# EAGLE design customESC_Test (EAGLE 9.6.2)

## Sheet 1 of 2
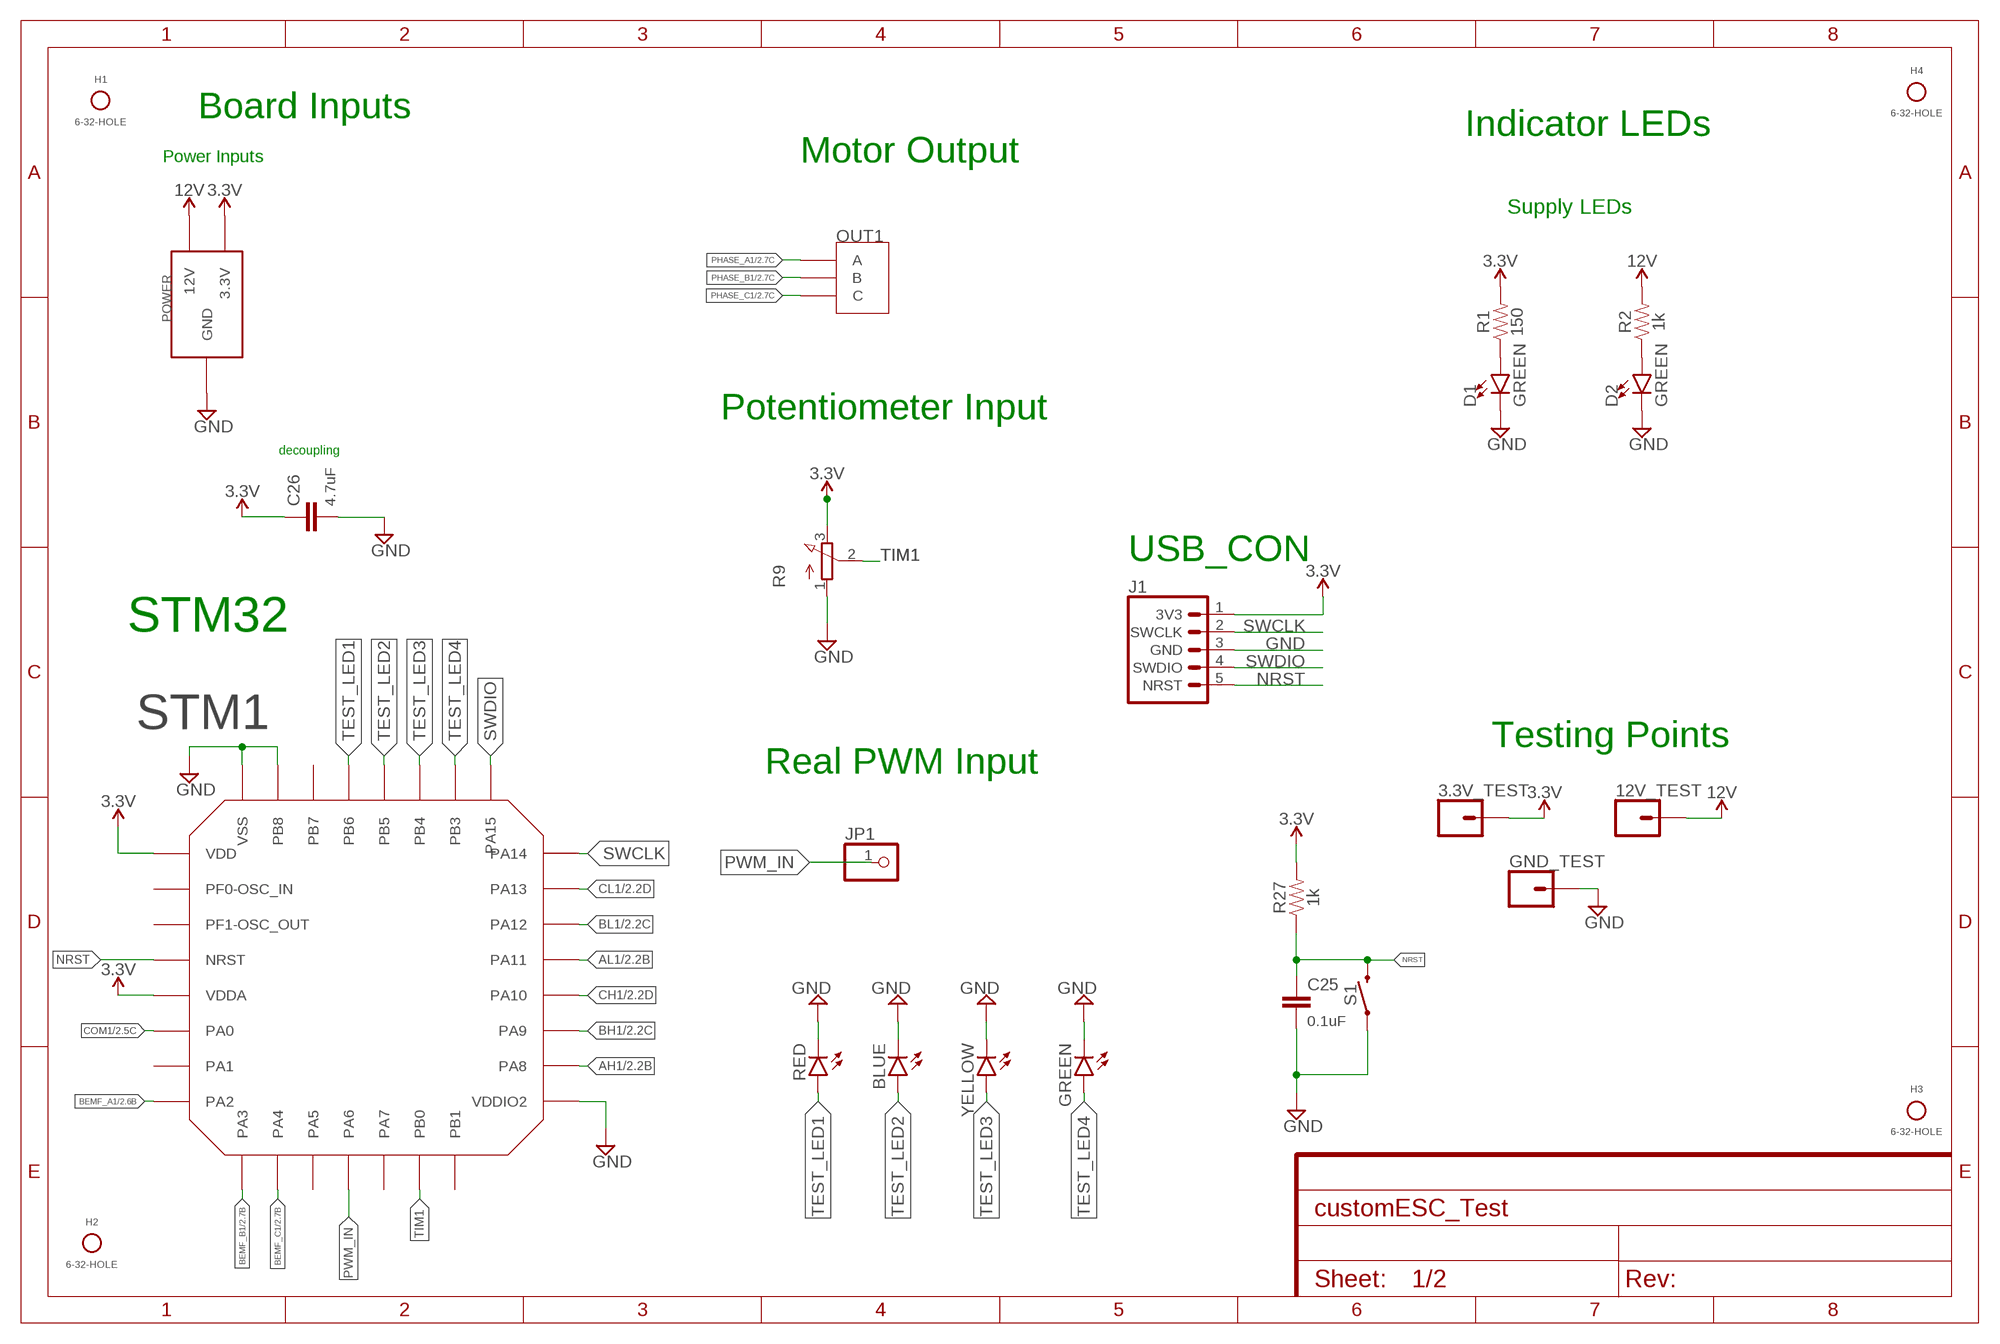
[diagram p0: schematic, sheet 1]

### Parts
3.3V_TEST  CONN_01  [1X01]
12V_TEST  CONN_01  [1X01]
BLUE  LEDCHIPLED_0805  [CHIPLED_0805]
C25  0.1uF  10UF-0603-6.3V-20%  [0603]
C26  4.7uF  10UF-0603-6.3V-20%  [0603]
D1  GREEN  LED-GREEN0603  [LED-0603]
D2  GREEN  LED-GREEN0603  [LED-0603]
GND_TEST  CONN_01  [1X01]
GREEN  LEDCHIPLED_0805  [CHIPLED_0805]
H1  6-32-HOLE  [MOUNTING_HOLE]
H2  6-32-HOLE  [MOUNTING_HOLE]
H3  6-32-HOLE  [MOUNTING_HOLE]
H4  6-32-HOLE  [MOUNTING_HOLE]
J1  3V3 -SWCLK-GND-SWDIO- NRST  SWD_CONN  [1X05]
JP1  PINHD-1X1  [1X01]
OUT1  IPBT-103-H1-T-S  [IPBT-103-H1-T-S]
POWER  12V-CONNECTOR  [12V-CONNECTOR]
R1  150  1KOHM-0603-1/10W-1%  [0603]
R2  1k  1KOHM-0603-1/10W-1%  [0603]
R9  3RP/1610N  [3RP/1610N]
R27  1k  1KOHM-0603-1/10W-1%  [0603]
RED  LEDCHIPLED_0805  [CHIPLED_0805]
S1  MOMENTARY-SWITCH-SPST-SMD-6.0X3.5MM  [TACTILE_SWITCH_SMD_6.0X3.5MM]
STM1  STM32F042K6T6  [STM32F042K6T6]
YELLOW  LEDCHIPLED_0805  [CHIPLED_0805]

### Nets
AH1: STM1.PA8 ; also sheet 2
AL1: STM1.PA11 ; also sheet 2
BEMF_A1: STM1.PA2 ; also sheet 2
BEMF_B1: STM1.PA3 ; also sheet 2
BEMF_C1: STM1.PA4 ; also sheet 2
BH1: STM1.PA9 ; also sheet 2
BL1: STM1.PA12 ; also sheet 2
CH1: STM1.PA10 ; also sheet 2
CL1: STM1.PA13 ; also sheet 2
COM1: STM1.PA0 ; also sheet 2
GND: BLUE.C C25.2 C26.2 D1.C D2.C GND_TEST.1 GREEN.C J1.3(GND) POWER.GND POWER.GND@1(GND) POWER.GND@2(GND) POWER.GND@3(GND) POWER.GND@4(GND) POWER.GND@5(GND) POWER.GND@6(GND) POWER.GND@7(GND) POWER.GND@8(GND) POWER.GND@9(GND) POWER.GND@10(GND) POWER.GND@11(GND) POWER.GND@12(GND) R9.1(A) RED.C S1.1 STM1.PB8-BOOT0(PB8) STM1.VDDIO2 STM1.VSS STM1.VSS1(VSS) YELLOW.C ; also sheet 2
N$1: D1.A R1.1
N$2: D2.A R2.1
NRST: C25.1 J1.5(NRST) R27.1 S1.2 STM1.NRST
PHASE_A1: OUT1.1(A) ; also sheet 2
PHASE_B1: OUT1.2(B) ; also sheet 2
PHASE_C1: OUT1.3(C) ; also sheet 2
PWM_IN: JP1.1 STM1.PA6
SWCLK: J1.2(SWCLK) STM1.PA14
SWDIO: J1.4(SWDIO) STM1.PA15
TEST_LED1: RED.A STM1.PB6
TEST_LED2: BLUE.A STM1.PB5
TEST_LED3: STM1.PB4 YELLOW.A
TEST_LED4: GREEN.A STM1.PB3
TIM1: R9.2(S) STM1.PB0
VCC_1: 3.3V_TEST.1 C26.1 J1.1(3V3) POWER.3.3V R1.2 R9.3(E) R27.2 STM1.VDD STM1.VDDA ; supply symbol labelled 3.3V
VCC_2: 12V_TEST.1 POWER.12V@1(12V) POWER.12V@2(12V) POWER.12V@3(12V) POWER.12V@4(12V) POWER.12V@5(12V) POWER.12V@6(12V) POWER.12V@7(12V) POWER.12V@8(12V) POWER.12V@9(12V) POWER.12V@10(12V) POWER.12V@11(12V) POWER.12V@12(12V) R2.2 ; supply symbol labelled 12V ; also sheet 2
Unconnected: STM1.PA1 STM1.PA5 STM1.PA7 STM1.PB1 STM1.PB7 STM1.PF0-OSC_IN STM1.PF1-OSC_OUT

### Notes on the sheet
- Board Inputs
- Indicator LEDs
- Power Inputs | Motor Output
- Supply LEDs
- Potentiometer Input
- decoupling
- USB_CON
- STM32
- Testing Points
- Real PWM Input

## Sheet 2 of 2
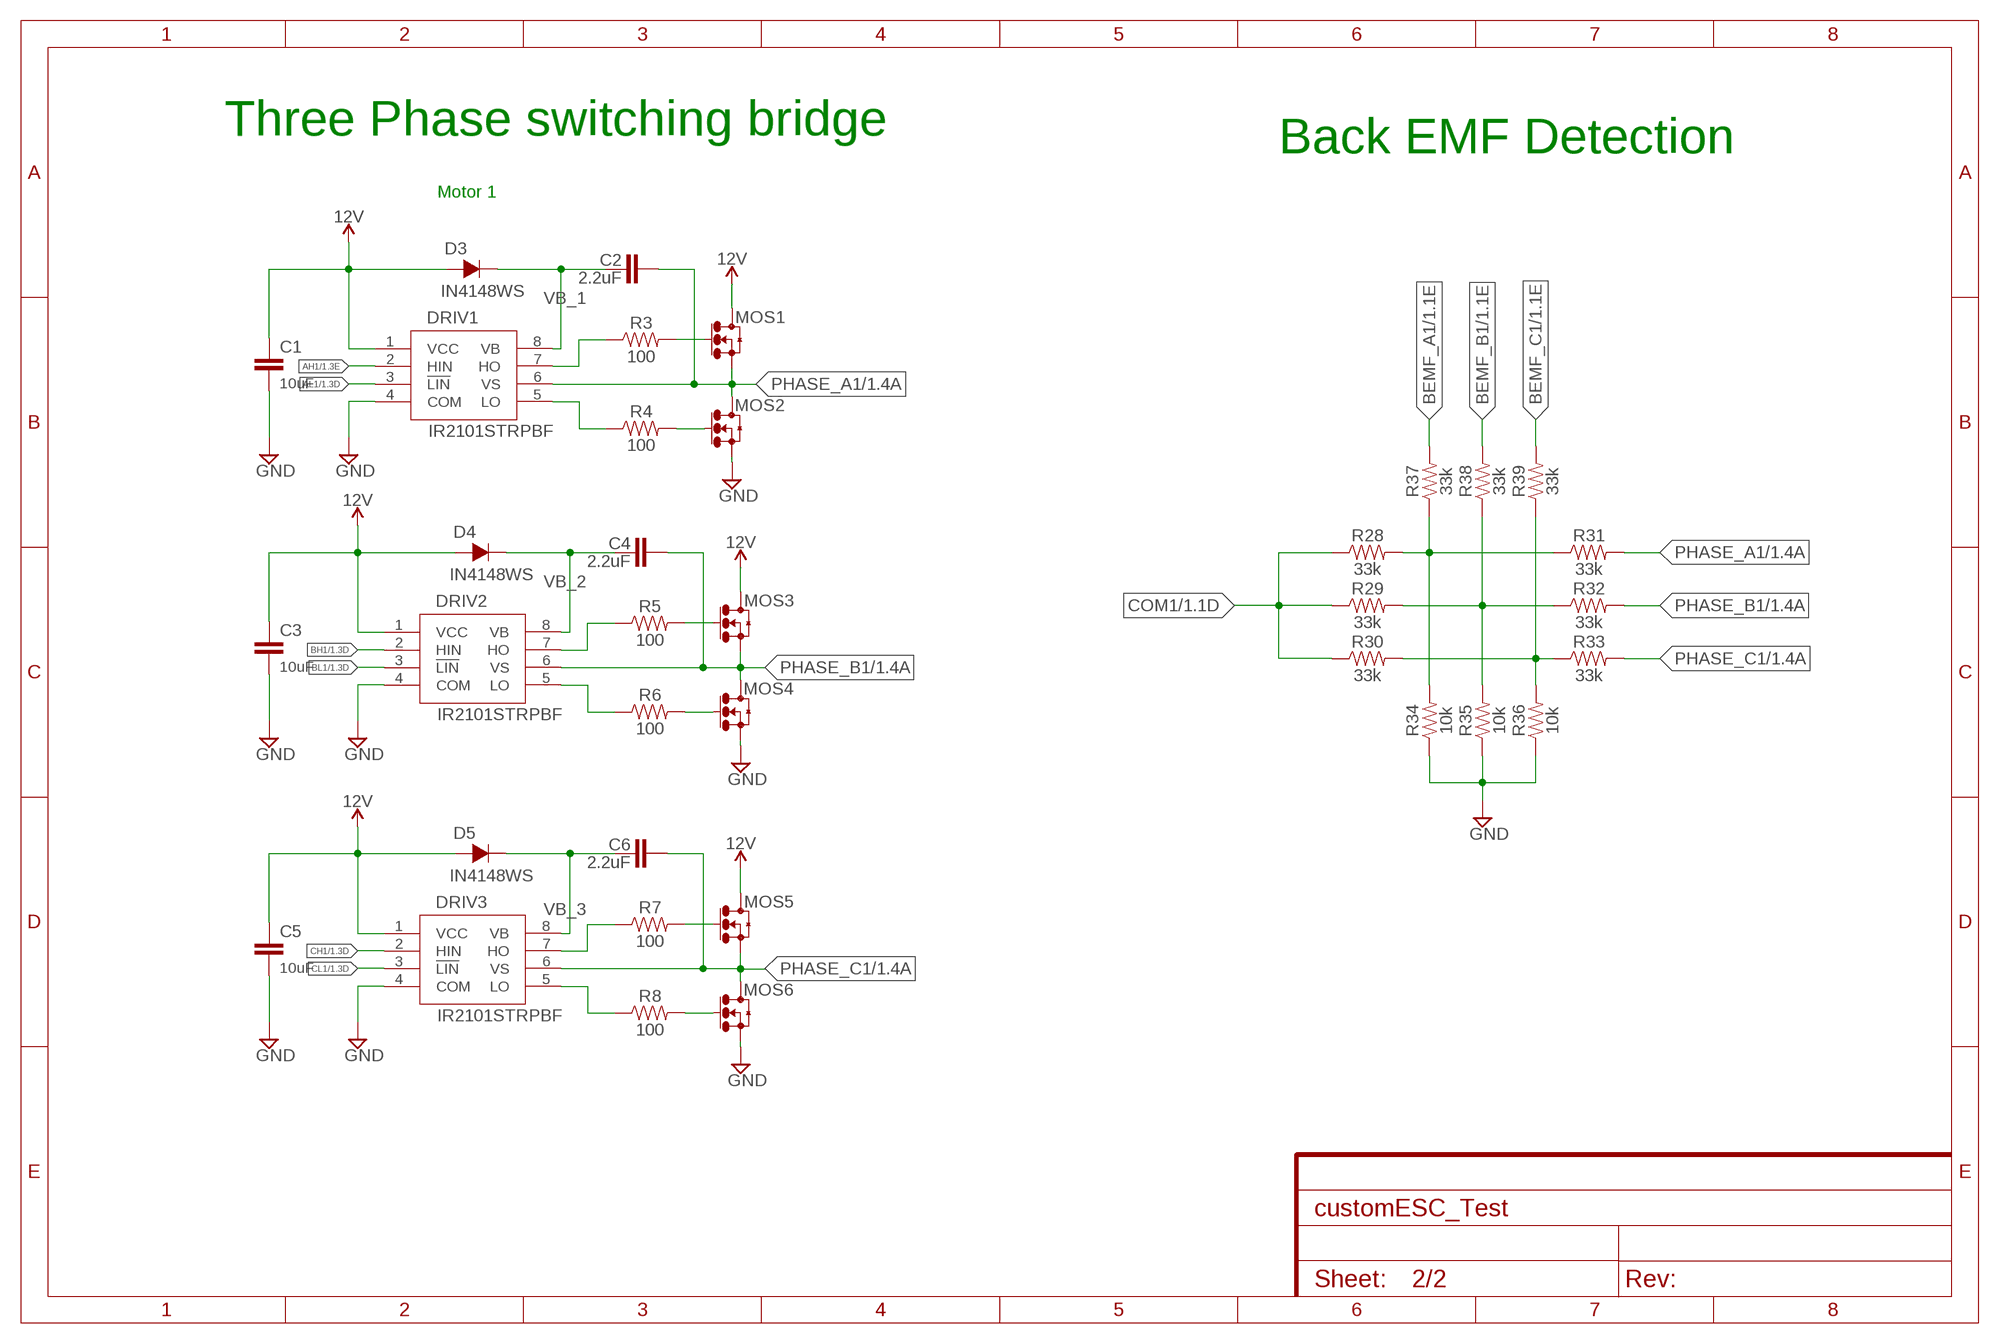
[diagram p1: schematic, sheet 2]

### Parts
C1  10uF  10UF-0603-6.3V-20%  [0603]
C2  2.2uF  10UF-0603-6.3V-20%  [0603]
C3  10uF  10UF-0603-6.3V-20%  [0603]
C4  2.2uF  10UF-0603-6.3V-20%  [0603]
C5  10uF  10UF-0603-6.3V-20%  [0603]
C6  2.2uF  10UF-0603-6.3V-20%  [0603]
D3  IN4148WS  [IN4148WS]
D4  IN4148WS  [IN4148WS]
D5  IN4148WS  [IN4148WS]
DRIV1  IR2101STRPBF  [IR2101STRPBF]
DRIV2  IR2101STRPBF  [IR2101STRPBF]
DRIV3  IR2101STRPBF  [IR2101STRPBF]
MOS1  IRLR7843TRPBF  [IRLR7843TRPBF]
MOS2  IRLR7843TRPBF  [IRLR7843TRPBF]
MOS3  IRLR7843TRPBF  [IRLR7843TRPBF]
MOS4  IRLR7843TRPBF  [IRLR7843TRPBF]
MOS5  IRLR7843TRPBF  [IRLR7843TRPBF]
MOS6  IRLR7843TRPBF  [IRLR7843TRPBF]
R3  100  1KOHM-0603-1/10W-1%  [0603]
R4  100  1KOHM-0603-1/10W-1%  [0603]
R5  100  1KOHM-0603-1/10W-1%  [0603]
R6  100  1KOHM-0603-1/10W-1%  [0603]
R7  100  1KOHM-0603-1/10W-1%  [0603]
R8  100  1KOHM-0603-1/10W-1%  [0603]
R28  33k  1KOHM-0603-1/10W-1%  [0603]
R29  33k  1KOHM-0603-1/10W-1%  [0603]
R30  33k  1KOHM-0603-1/10W-1%  [0603]
R31  33k  1KOHM-0603-1/10W-1%  [0603]
R32  33k  1KOHM-0603-1/10W-1%  [0603]
R33  33k  1KOHM-0603-1/10W-1%  [0603]
R34  10k  1KOHM-0603-1/10W-1%  [0603]
R35  10k  1KOHM-0603-1/10W-1%  [0603]
R36  10k  1KOHM-0603-1/10W-1%  [0603]
R37  33k  1KOHM-0603-1/10W-1%  [0603]
R38  33k  1KOHM-0603-1/10W-1%  [0603]
R39  33k  1KOHM-0603-1/10W-1%  [0603]

### Nets
AH1: DRIV1.2(HIN) ; also sheet 1
AL1: DRIV1.3(!LIN) ; also sheet 1
BEMF_A1: R37.2 ; also sheet 1
BEMF_B1: R38.2 ; also sheet 1
BEMF_C1: R39.2 ; also sheet 1
BH1: DRIV2.2(HIN) ; also sheet 1
BL1: DRIV2.3(!LIN) ; also sheet 1
CH1: DRIV3.2(HIN) ; also sheet 1
CL1: DRIV3.3(!LIN) ; also sheet 1
COM1: R28.1 R29.1 R30.1 ; also sheet 1
GND: C1.2 C3.2 C5.2 DRIV1.4(COM) DRIV2.4(COM) DRIV3.4(COM) MOS2.2(DRAIN) MOS2.4(DRAIN) MOS4.2(DRAIN) MOS4.4(DRAIN) MOS6.2(DRAIN) MOS6.4(DRAIN) R34.1 R35.1 R36.1 ; also sheet 1
N$4: DRIV1.7(HO) R3.1
N$5: MOS1.1(GATE) R3.2
N$6: DRIV1.5(LO) R4.1
N$7: MOS2.1(GATE) R4.2
N$9: DRIV2.7(HO) R5.1
N$10: DRIV2.5(LO) R6.1
N$11: MOS3.1(GATE) R5.2
N$12: MOS4.1(GATE) R6.2
N$14: DRIV3.7(HO) R7.1
N$15: DRIV3.5(LO) R8.1
N$16: MOS5.1(GATE) R7.2
N$17: MOS6.1(GATE) R8.2
N$64: R28.2 R31.1 R34.2 R37.1
N$65: R29.2 R32.1 R35.2 R38.1
N$66: R30.2 R33.1 R36.2 R39.1
PHASE_A1: C2.2 DRIV1.6(VS) MOS1.2(DRAIN) MOS1.4(DRAIN) MOS2.3(SOURCE) R31.2 ; also sheet 1
PHASE_B1: C4.2 DRIV2.6(VS) MOS3.2(DRAIN) MOS3.4(DRAIN) MOS4.3(SOURCE) R32.2 ; also sheet 1
PHASE_C1: C6.2 DRIV3.6(VS) MOS5.2(DRAIN) MOS5.4(DRAIN) MOS6.3(SOURCE) R33.2 ; also sheet 1
VB_1: C2.1 D3.P$2 DRIV1.8(VB)
VB_2: C4.1 D4.P$2 DRIV2.8(VB)
VB_3: C6.1 D5.P$2 DRIV3.8(VB)
VCC_2: C1.1 C3.1 C5.1 D3.P$1 D4.P$1 D5.P$1 DRIV1.1(VCC) DRIV2.1(VCC) DRIV3.1(VCC) MOS1.3(SOURCE) MOS3.3(SOURCE) MOS5.3(SOURCE) ; supply symbol labelled 12V ; also sheet 1

### Notes on the sheet
- Three Phase switching bridge
- Back EMF Detection
- Motor 1

## Library data of the parts
3.3V_TEST 12V_TEST GND_TEST = SparkFun-Connectors:CONN_01: Single connection point. Often used as Generic Header-pin footprint for 0.1 inch spaced/style header connections On any of the 0.1 inch spaced packages, you can populate with these: Break Away Headers - Straight <https://www.sparkfun.com/products/116> (PRT-00116) Break Away Male Headers - Right Angle <https://www.sparkfun.com/products/553> (PRT-00553) Female Headers <https://www.sparkfun.com/products/115> (PRT-00115) Break Away Headers - Machine Pin <https://www.sparkfun.com/products/117> (PRT-00117) Break Away Female Headers - Swiss Machine Pin <https://www.sparkfun.com/products/743> (PRT-00743) This device is also useful as a general connection point to wire up your design to another part of your project. Our various solder wires solder well into these plated through hole pads. Hook-Up Wire - Assortment (Stranded, 22 AWG) <https://www.sparkfun.com/products/11375> (PRT-11375) Hook-Up Wire - Assortment (Solid Core, 22 AWG) <https://www.sparkfun.com/products/11367> (PRT-11367) View the entire wire category on our website here <https://www.sparkfun.com/categories/141> Special notes: SMTSO-256-ET is a "flush mount" nut for a 4-40 screw. We mostly use this on specialty testbeds; it is a nice way to connect hardware to your PCB at an adjustable hieght. Also note, the SNAP packages are for using a snappable style connector. We sell a baggie of snaps and they are also used on two LilyPad designs: Snap Assortment - 30 pack (male and female) <https://www.sparkfun.com/products/11347> (DEV-11347) LilyPad Arduino SimpleSnap <https://www.sparkfun.com/products/10941> (DEV-10941) LilyPad SimpleSnap Protoboard <https://www.sparkfun.com/products/10940> (DEV-10940)
BLUE GREEN RED YELLOW = led:LED: LED OSRAM: - CHIPLED LG R971, LG N971, LY N971, LG Q971, LY Q971, LO R971, LY R971 LH N974, LH R974 LS Q976, LO Q976, LY Q976 LO Q996 - Hyper CHIPLED LW Q18S LB Q993, LB Q99A, LB R99A - SideLED LS A670, LO A670, LY A670, LG A670, LP A670 LB A673, LV A673, LT A673, LW A673 LH A674 LY A675 LS A676, LA A676, LO A676, LY A676, LW A676 LS A679, LY A679, LG A679 - Hyper Micro SIDELED® LS Y876, LA Y876, LO Y876, LY Y876 LT Y87S - SmartLED LW L88C, LW L88S LB L89C, LB L89S, LG L890 LS L89K, LO L89K, LY L89K LS L896, LA L896, LO L896, LY L896 - TOPLED LS T670, LO T670, LY T670, LG T670, LP T670 LSG T670, LSP T670, LSY T670, LOP T670, LYG T670 LG T671, LOG T671, LSG T671 LB T673, LV T673, LT T673, LW T673 LH T674 LS T676, LA T676, LO T676, LY T676, LB T676, LH T676, LSB T676, LW T676 LB T67C, LV T67C, LT T67C, LS T67K, LO T67K, LY T67K, LW E67C LS E67B, LA E67B, LO E67B, LY E67B, LB E67C, LV E67C, LT E67C LW T67C LS T679, LY T679, LG T679 LS T770, LO T770, LY T770, LG T770, LP T770 LB T773, LV T773, LT T773, LW T773 LH T774 LS E675, LA E675, LY E675, LS T675 LS T776, LA T776, LO T776, LY T776, LB T776 LHGB T686 LT T68C, LB T68C - Hyper Mini TOPLED® LB M676 - Mini TOPLED Santana® LG M470 LS M47K, LO M47K, LY M47K Source: http://www.osram.convergy.de LUXEON: - LUMILED® LXK2-PW12-R00, LXK2-PW12-S00, LXK2-PW14-U00, LXK2-PW14-V00 LXK2-PM12-R00, LXK2-PM12-S00, LXK2-PM14-U00 LXK2-PE12-Q00, LXK2-PE12-R00, LXK2-PE12-S00, LXK2-PE14-T00, LXK2-PE14-U00 LXK2-PB12-K00, LXK2-PB12-L00, LXK2-PB12-M00, LXK2-PB14-N00, LXK2-PB14-P00, LXK2-PB14-Q00 LXK2-PR12-L00, LXK2-PR12-M00, LXK2-PR14-Q00, LXK2-PR14-R00 LXK2-PD12-Q00, LXK2-PD12-R00, LXK2-PD12-S00 LXK2-PH12-R00, LXK2-PH12-S00 LXK2-PL12-P00, LXK2-PL12-Q00, LXK2-PL12-R00 Source: www.luxeon.com KINGBRIGHT: KA-3528ASYC Source: www.kingbright.com
C1 C3 C5 = SparkFun-Capacitors:10UF: 10.0µF ceramic capacitors A capacitor is a passive two-terminal electrical component used to store electrical energy temporarily in an electric field.; PROD_ID: CAP-11015
C2 C4 C6 C25 C26 = SparkFun-Capacitors:10UF: 10.0µF ceramic capacitors A capacitor is a passive two-terminal electrical component used to store electrical energy temporarily in an electric field.; PROD_ID: CAP-11015; VALUE: 10uF
D1 D2 = SparkFun-LED:LED-GREEN: Green SMD LED Used in manufacturing of various products at SparkFun Packages: 0603 - SMD 0603 package [Product Link] <http://www.futureelectronics.com/en/technologies/semiconductors/optoelectronics/leds/Pages/9894312-LTST-C190GKT.aspx?CrossPart=HSMG-C190&IM=0> LilyPad 1206 - SMD1206 LilyPad package [Product Link] <http://www.futureelectronics.com/en/Technologies/Product.aspx?ProductID=IN150NGHARVATEKCORPORATION2049943&IM=0> 1206 - SMD1206 package [Product Link] <http://www.futureelectronics.com/en/technologies/semiconductors/optoelectronics/leds/Pages/8315665-LTST-C150KGKT.aspx?IM=0> 1206 Bottom Mount -SMD 1206 Bottom Mount [Product Link] <http://www.digikey.com/product-detail/en/lite-on-inc/LTST-C230KGKT/160-1456-1-ND/386854> SparkFun Products: Pro Mini 328 -5V <https://www.sparkfun.com/products/821> RedBoard <https://www.sparkfun.com/products/12757> MP3 Trigger <https://www.sparkfun.com/products/13720> Makey Makey <https://www.sparkfun.com/products/11076>; PROD_ID: DIO-00821
D3-D5 = X15-CustomESC:IN4148WS
DRIV1-DRIV3 = X15-CustomESC:IR2101STRPBF: High and Low Side MOSFET Gate Driver Half-Bridge This is used in drving half-bridge in ESC circuit.
H1-H4 = X15-CustomESC:6-32-HOLE: 6-32 Mounting Hole Mounting hole for the scaffolding in the box
J1 = X15-ESC-Controller-Parts-Library:SWD_CONN
JP1 = pinhead:PINHD-1X1: PIN HEADER
MOS1-MOS6 = X15-CustomESC:IRLR7843TRPBF: HEXFET power MOSFET N-CHANNEL 30V 3.3mOhm 161A
OUT1 = X15-CustomESC:IPBT-103-H1-T-S
POWER = X15-CustomESC:12V-CONNECTOR: 12V backplane connector Connector to the backplane for 12V input
R1 R3-R8 R28-R39 = SparkFun-Resistors:1KOHM: 1kΩ resistor A resistor is a passive two-terminal electrical component that implements electrical resistance as a circuit element. Resistors act to reduce current flow, and, at the same time, act to lower voltage levels within circuits. - Wikipedia; PROD_ID: RES-07856; VALUE: 1k
R2 R27 = SparkFun-Resistors:1KOHM: 1kΩ resistor A resistor is a passive two-terminal electrical component that implements electrical resistance as a circuit element. Resistors act to reduce current flow, and, at the same time, act to lower voltage levels within circuits. - Wikipedia; PROD_ID: RES-07856
R9 = pot:3RP/1610N: 16mm Potentiometer one level Source: http://www.alphapotentiometers.net/html/16mm_pot_2.html
S1 = SparkFun-Switches:MOMENTARY-SWITCH-SPST: Momentary Switch (Pushbutton) - SPST Normally-open (NO) SPST momentary switches (buttons, pushbuttons). Variants PTH-12MM - 12mm square, through-hole Momentary Pushbutton Switch - 12mm Square <https://www.sparkfun.com/products/9190> (COM-09190) PTH-6.0MM, PTH-6.0MM-KIT - 6.0mm square, through-hole Mini Pushbutton Switch <https://www.sparkfun.com/products/97> (COM-00097) KIT package intended for soldering kit's - only one side of pads' copper is exposed. PTH-RIGHT-ANGLE-KIT - Right-angle, through-hole Right Angle Tactile Button <https://www.sparkfun.com/products/10791> - Used on SparkFun BigTime Watch Kit <https://www.sparkfun.com/products/11734> SMD-12MM - 12mm square, surface-mount Tactile Button - SMD (12mm) <https://www.sparkfun.com/products/12993> (COM-12993) Used on SparkFun PicoBoard <https://www.sparkfun.com/products/11888> SMD-4.5MM - 4.5mm Square Trackball Switch Used on SparkFun Blackberry Trackballer Breakout <https://www.sparkfun.com/products/13169> SMD-4.6MMX2.8MM - 4.60mm x 2.80mm, surface mount Used on SparkFun SAMD21 Mini Breakout <https://www.sparkfun.com/products/13664> SMD-5.2MM, SMD-5.2-REDUNDANT - 5.2mm square, surface-mount Mini Pushbutton Switch - SMD <https://www.sparkfun.com/products/8720> (COM-08720) Used on Arduino Pro Mini <https://www.sparkfun.com/products/11114> REDUNDANT package connects both switch circuits together SMD-6.0X3.5MM - 6.0 x 3.5mm, surface mount Momentary Reset Switch SMD <https://www.sparkfun.com/products/8229> (COM-08229) SMD-6.2MM-TALL - 6.2mm square, surface mount Tactile Button - SMD (6mm) <https://www.sparkfun.com/products/12992> Used on SparkFun Digital Sandbox <https://www.sparkfun.com/products/12651> SMD-RIGHT-ANGLE - Right-angle, surface mount Used on SparkFun Block for Intel® Edison - Arduino <https://www.sparkfun.com/products/13036>; PROD_ID: SWCH-00815; SF_SKU: COM-08229
STM1 = X15-CustomESC:STM32F042K6T6: STM32F042K6T6 chip ST Microcontroller chip

## Board
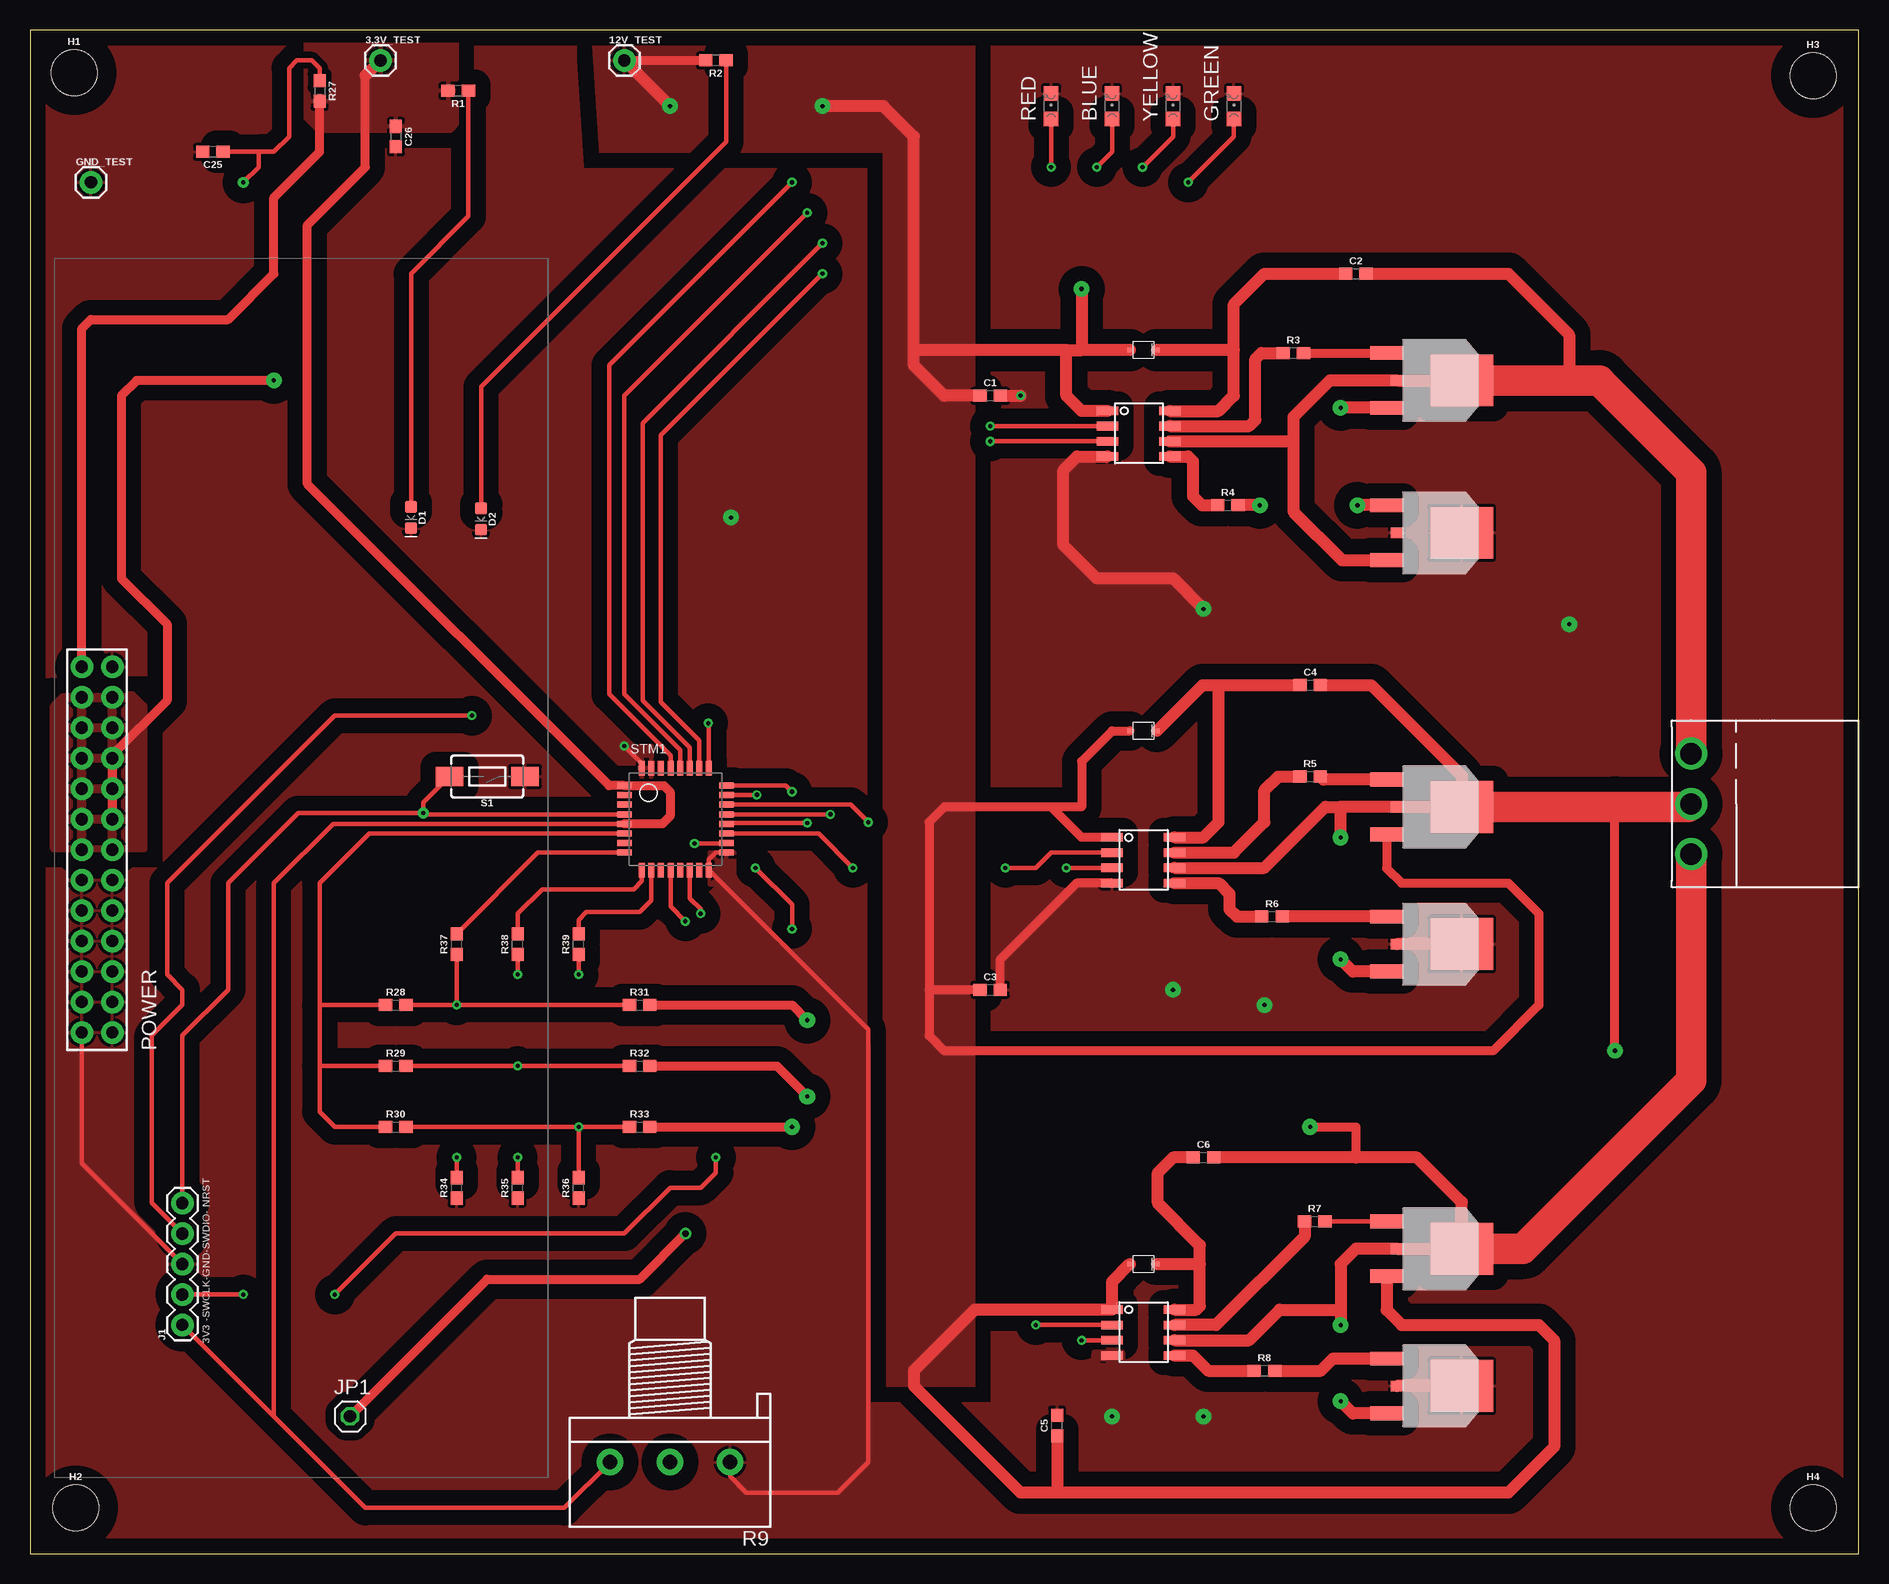
[diagram p2: board, top side]
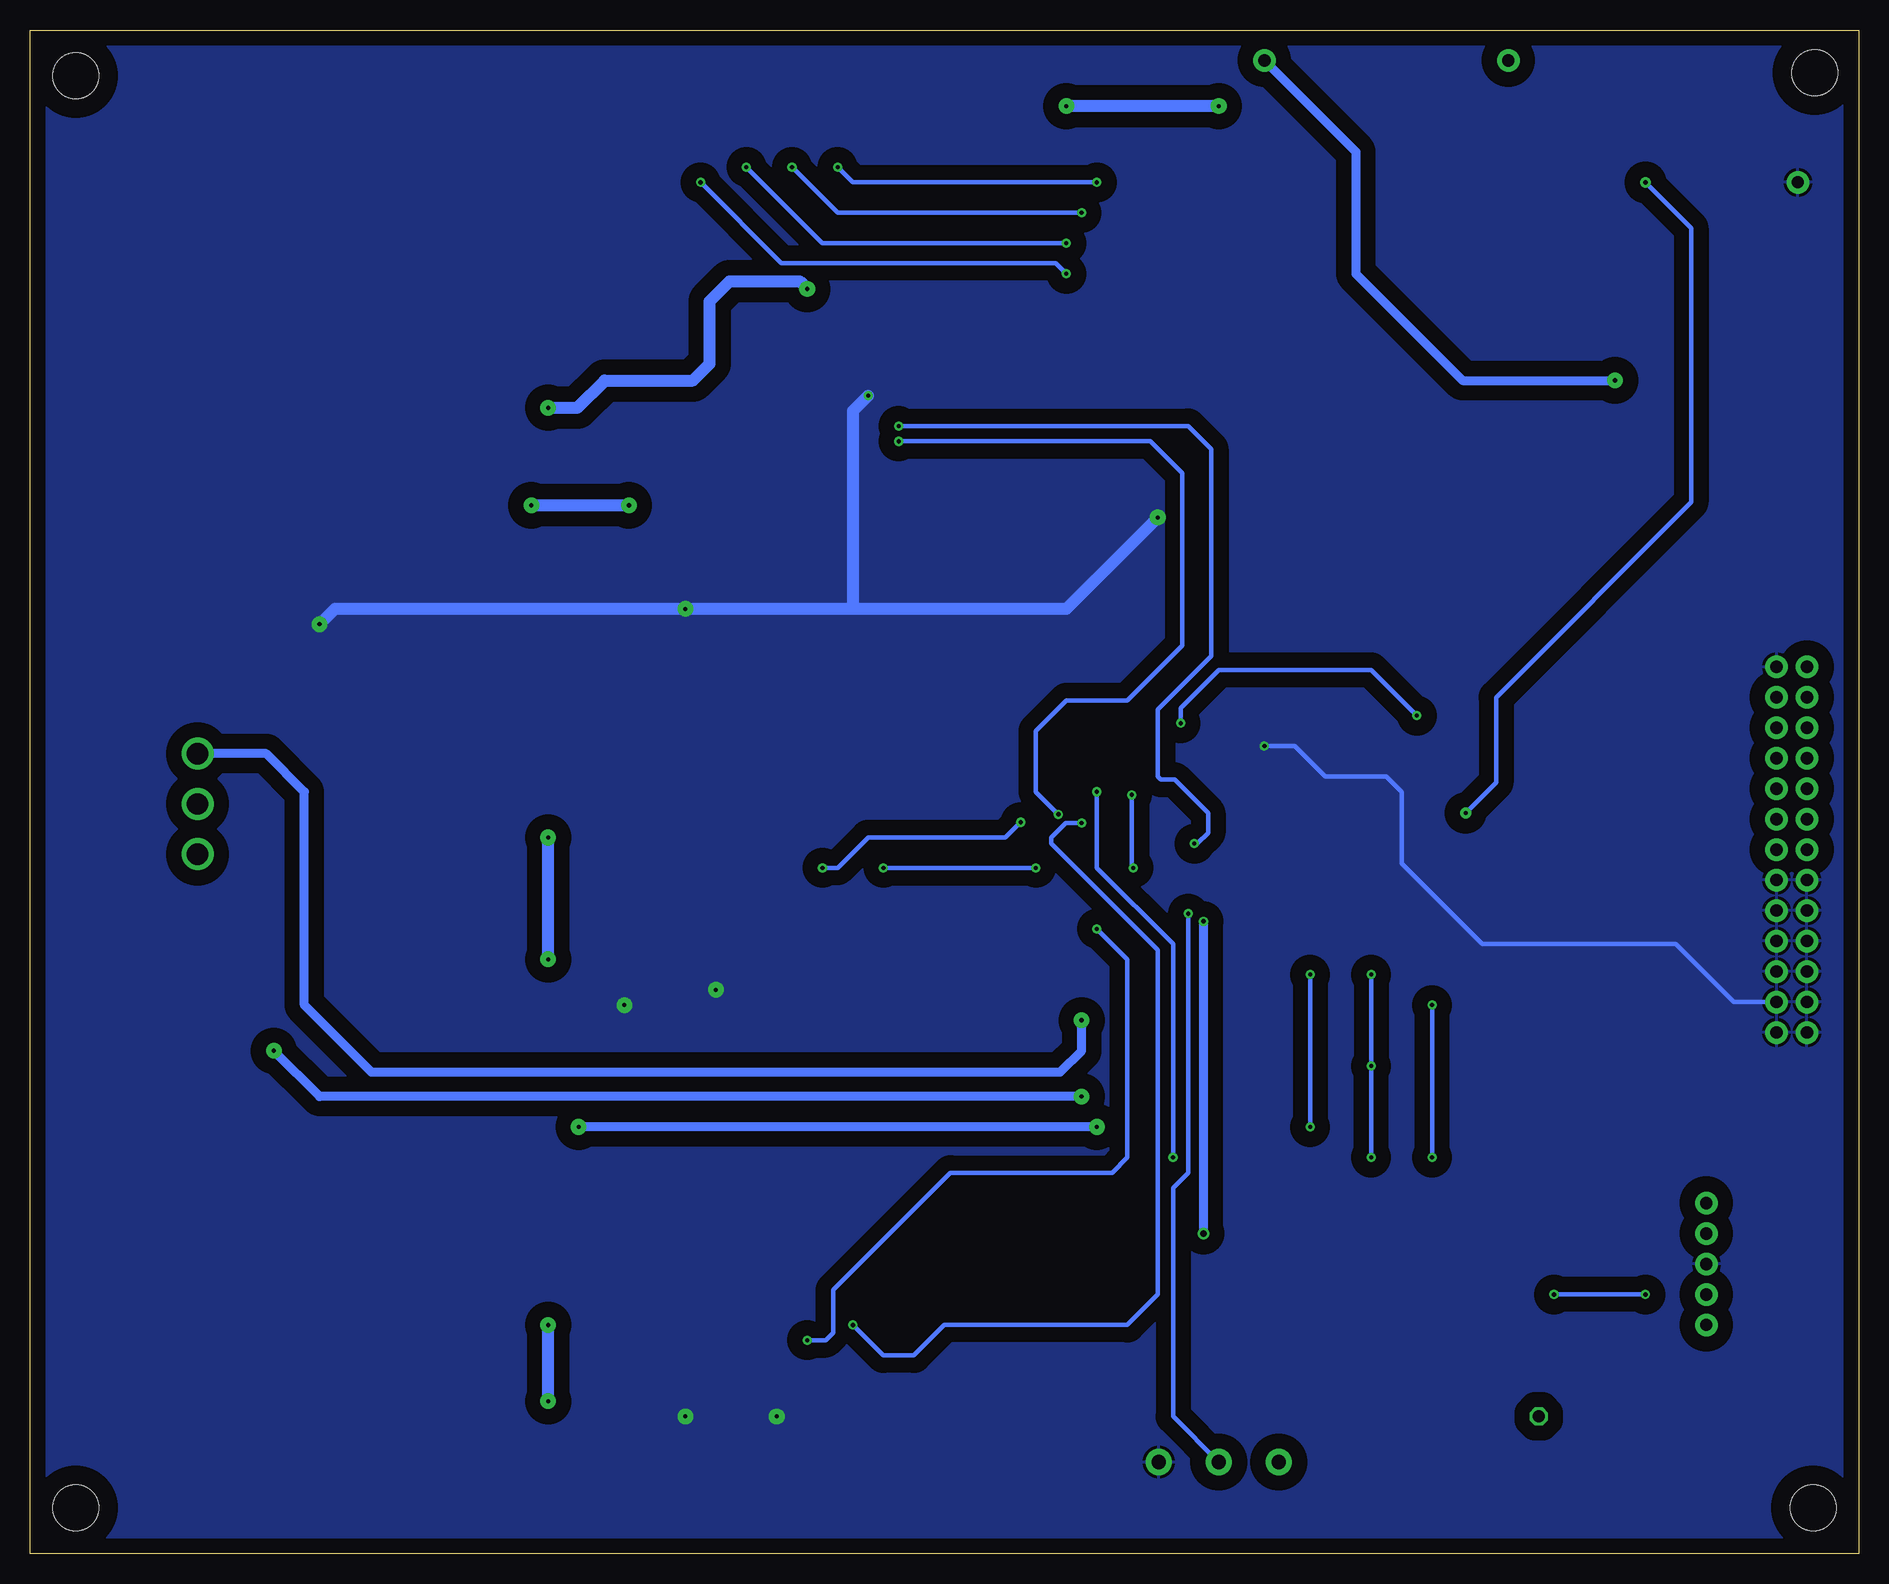
[diagram p3: board, bottom side, seen from below]

Size 152.4 x 127 mm. Coordinates in mm from the lower left corner, seen from the top.
Outline: 0,0 152.4,0 152.4,127 0,127 0,0
Copper layers (1*16): Top 0.035mm / dielectric 1.5mm / Bottom 0.035mm
Design rules "477": minimum track width 6mil, minimum drill 0.35mm, track to track 6mil, track to pad 6mil, pad to pad 6mil, via to via 6mil, smd to smd 6mil, copper to edge 40mil, drill to drill 6mil, minimum pad ring 10mil, minimum via ring 8mil, stop-mask expansion 4mil, vias tented up to drill 0mil, thermal gap 10mil

### Footprints (pad centres in the part's own frame; a part is rotated, then mirrored left to right if it is on the bottom)
1X01 = drill 1.016 pad 1.88: 1 0,0
CHIPLED_0805 = smd 1.2 x 1.2: A 0,-1.05; C 0,1.05
0603 = smd 1.1 x 1: 1 -0.85,0; 2 0.85,0
LED-0603 = smd 1 x 1: A -0.877,0; C 0.877,0
IN4148WS = smd 0.45 x 0.35: P$1 0.225,0; P$2 2.475,0
IR2101STRPBF = smd 0.711 x 1.778: 1 -1.27,-2.54; 2 0,-2.54; 3 1.27,-2.54; 4 2.54,-2.54; 5 2.54,2.667; 6 1.27,2.667; 7 0,2.667; 8 -1.27,2.667
MOUNTING_HOLE = hole 3.81: 0,0
1X05 = drill 1.016 pad 1.88: 1 0,0; 2 2.54,0; 3 5.08,0; 4 7.62,0; 5 10.16,0
1X01' = drill 1.016 octagon: 1 0,0
IRLR7843TRPBF = smd 1.143 x 2.743: 1 -2.286,-8.865; 3 2.286,-8.865 | smd 0.889 x 1.016: 2 0,-8.001 | smd 4.318 x 5.207: 4 0,-2.603
IPBT-103-H1-T-S = drill 1.778 pad 2.54: 1 -4.191,0; 2 0,0; 3 4.191,0
12V-CONNECTOR = drill 1.016 pad 1.88: 3.3V 67.564,38.862; 12V@1 65.024,36.322; 12V@2 65.024,38.862; 12V@3 62.484,36.322; 12V@4 62.484,38.862; 12V@5 59.944,36.322; 12V@6 59.944,38.862; 12V@7 57.404,36.322; 12V@8 57.404,38.862; 12V@9 54.864,36.322; 12V@10 54.864,38.862; 12V@11 52.324,36.322; 12V@12 52.324,38.862; GND 67.564,36.322; GND@1 49.784,38.862; GND@2 49.784,36.322; GND@3 47.244,38.862; GND@4 47.244,36.322; GND@5 44.704,38.862; GND@6 44.704,36.322; GND@7 42.164,38.862; GND@8 42.164,36.322; GND@9 39.624,38.862; GND@10 39.624,36.322; GND@11 37.084,38.862; GND@12 37.084,36.322
3RP/1610N = drill 1.2 pad 2.184: 1 -5,0; 2 0,0; 3 5,0
TACTILE_SWITCH_SMD_6.0X3.5MM = smd 2.3 x 1.6: 1 -3.15,0; 2 3.15,0
STM32F042K6T6 = smd 1.2 x 0.5: NRST 0,3.2; PA0 0,1.6; PA1 0,0.8; PA2 0,0; PA8 8.5,0.8; PA9 8.5,1.6; PA10 8.5,2.4; PA11 8.5,3.2; PA12 8.5,4; PA13 8.5,4.8; PA14 8.5,5.6; PF0-OSC_IN 0,4.8; PF1-OSC_OUT 0,4; VDD 0,5.6; VDDA 0,2.4; VDDIO2 8.5,0 | smd 0.5 x 1.2: PA3 1.45,-1.45; PA4 2.25,-1.45; PA5 3.05,-1.45; PA6 3.85,-1.45; PA7 4.65,-1.45; PA15 7.05,7.05; PB0 5.45,-1.45; PB1 6.25,-1.45; PB3 6.25,7.05; PB4 5.45,7.05; PB5 4.65,7.05; PB6 3.85,7.05; PB7 3.05,7.05; PB8-BOOT0 2.25,7.05; VSS 7.05,-1.45; VSS1 1.45,7.05

### Placement (x,y rotation side)
3.3V_TEST  29.21,124.46 0 top
12V_TEST  49.53,124.46 0 top
BLUE  90.17,120.65 0 top
C1  80.01,96.52 0 top
C2  110.49,106.68 0 top
C3  80.01,46.99 0 top
C4  106.68,72.39 0 top
C5  85.6,10.67 90 top
C6  97.79,33.02 0 top
C25  15.24,116.84 180 top
C26  30.48,118.11 270 top
D1  31.75,86.36 270 top
D2  37.59,86.23 270 top
D3  91.44,100.33 0 top
D4  91.44,68.58 0 top
D5  91.44,24.13 0 top
DRIV1  92.33,93.98 270 top
DRIV2  92.71,58.42 270 top
DRIV3  92.71,19.05 270 top
GND_TEST  5.08,114.3 0 top
GREEN  100.33,120.65 0 top
H1  3.68,123.44 0 top
H2  3.81,3.81 0 top
H3  148.59,123.19 0 top
H4  148.59,3.81 0 top
J1  12.7,19.05 90 top
JP1  [1X01']  26.67,11.43 0 top
MOS1  121.92,97.79 270 top
MOS2  121.92,85.09 270 top
MOS3  121.92,62.23 270 top
MOS4  121.92,50.8 270 top
MOS5  121.92,25.4 270 top
MOS6  121.92,13.97 270 top
OUT1  138.43,62.48 270 top
POWER  43.18,6.35 90 top
R1  35.69,121.92 180 top
R2  57.15,124.46 180 top
R3  105.28,100.08 0 top
R4  99.82,87.38 0 top
R5  106.68,64.77 0 top
R6  103.5,53.09 0 top
R7  107.06,27.69 0 top
R8  102.87,15.24 0 top
R9  53.34,7.62 180 top
R27  24.13,121.92 270 top
R28  30.48,45.72 0 top
R29  30.48,40.64 0 top
R30  30.48,35.56 0 top
R31  50.8,45.72 0 top
R32  50.8,40.64 0 top
R33  50.8,35.56 0 top
R34  35.56,30.48 90 top
R35  40.64,30.48 90 top
R36  45.72,30.48 90 top
R37  35.56,50.8 90 top
R38  40.64,50.8 90 top
R39  45.72,50.8 90 top
RED  85.09,120.65 0 top
S1  38.1,64.77 180 top
STM1  49.53,58.42 0 top
YELLOW  95.25,120.65 0 top

### Tracks (layer width: path | path; a pad name or v marks a point on that pad's centre or on a via)
AH1  (via drill 0.35)
  Top 0.381: DRIV1.2 v80.01,93.98 | v55.37,59.18 57.99,59.18 STM1.PA8
  Bottom 0.381: v80.01,93.98 55.88,93.98 53.98,92.08 53.98,74.8 58.42,70.36 58.42,64.77 58.17,64.52 57.02,64.52 54.23,61.72 54.23,60.07 55.12,59.18 v55.37,59.18
AL1  (via drill 0.35)
  Top 0.381: DRIV1.3 v80.01,92.71 | STM1.PA11 v66.7,61.62
  Bottom 0.381: v80.01,92.71 59.05,92.71 56.39,90.04 56.39,75.69 60.96,71.12 66.04,71.12 68.58,68.58 68.58,63.5 v66.7,61.62
BEMF_A1
  Top 0.381: R37.2 42.33,58.42 STM1.PA2
BEMF_B1
  Top 0.381: STM1.PA3 50.98,56.06 50.29,55.37 42.67,55.37 40.64,53.34 R38.2
BEMF_C1
  Top 0.381: R39.2 45.72,52.83 46.35,53.47 50.8,53.47 51.78,54.45 STM1.PA4
BH1  (via drill 0.35)
  Top 0.381: DRIV2.2 85.09,58.42 83.82,57.15 v81.28,57.15 | STM1.PA9 65.71,60.02 v68.58,57.15
  Bottom 0.381: v81.28,57.15 v68.58,57.15
BL1  (via drill 0.35)
  Top 0.381: STM1.PA12 68.39,62.42 v69.85,60.96 | v86.36,57.15 DRIV2.3
  Bottom 0.381: v69.85,60.96 71.12,59.69 82.55,59.69 85.09,57.15 v86.36,57.15
CH1  (via drill 0.35)
  Top 0.381: STM1.PA10 58.11,60.9 v64.77,60.9 | v83.82,19.05 DRIV3.2
  Bottom 0.381: v64.77,60.9 66.1,60.9 67.31,59.69 67.31,59.18 58.42,50.29 58.42,21.59 60.96,19.05 76.2,19.05 78.74,16.51 81.28,16.51 v83.82,19.05
CL1  (via drill 0.35)
  Top 0.381: DRIV3.3 v87.63,17.78 | v60.58,63.25 60.55,63.22 STM1.PA13 | v63.5,52.07 63.5,54.1 v60.45,57.15
  Bottom 0.381: v87.63,17.78 86.11,17.78 85.47,18.41 85.47,21.97 75.69,31.75 62.23,31.75 60.96,33.02 60.96,49.53 v63.5,52.07 | v60.58,63.25 60.58,57.28 v60.45,57.15
COM1
  Top 0.381: STM1.PA0 28.27,60.02 24.13,55.88 24.13,45.72 | 24.13,45.72 24.13,40.64 | 24.13,40.64 24.13,36.83 25.4,35.56 R30.1 | R29.1 24.13,40.64 | R28.1 24.13,45.72
GND  (via drill 0.35, 0.35 pad 1.3)
  Top 0.381: STM1.VDDIO2 57.15,58.42 56.58,57.85 STM1.VSS 69.85,43.7 69.85,7.62 67.31,5.08 59.69,5.08 58.34,6.43 R9.1 | v49.53,67.31 50.98,65.86 STM1.VSS1 | J1.3 4.32,32.51 POWER.GND@11
  Top 0.762: DRIV2.4 87.21,55.88 80.86,49.53 C3.2
  Top 1.016: MOS6.4 MOS6.2 | MOS4.4 MOS4.2 | C1.2 v82.55,96.52 | v97.79,78.74 95.25,81.28 88.9,81.28 86.11,84.07 86.11,90.3 87.25,91.44 DRIV1.4
  Bottom 0.381: POWER.GND@10 10.41,45.97 15.24,50.8 31.37,50.8 38.1,57.53 38.1,63.5 39.37,64.77 44.45,64.77 46.99,67.31 v49.53,67.31
  Bottom 1.016: v58.42,86.36 66.04,78.74 83.82,78.74 | 83.82,78.74 v97.79,78.74 127,78.74 v128.27,77.47 | v82.55,96.52 83.82,95.25 83.82,78.74
  other vias: 95.25,46.99 90.17,11.43 97.79,11.43 102.87,45.72
  pour Bottom (isolate 1.27, rank 3): -3.81,129.54 -3.81,-5.08 157.48,-5.08 158.75,-3.81 158.75,132.08 -1.27,132.08
  pour Top (isolate 1.27, rank 3): -16.51,-8.89 170.18,-8.89 170.18,135.89 166.37,139.7 -16.51,139.7
  pour Top: 58.55,58.42 56.64,58.42 56.64,55.75 58.67,55.75 58.67,58.42
  pour Top: 50.8,64.77 50.8,67.31 51.82,67.31 51.82,64.77
  pour Top: 90.55,16.64 88.9,16.64 88.9,15.11 90.81,15.11 90.81,16.64 90.68,16.64
N$1
  Top 0.381: R1.1 36.54,111.47 31.75,106.68 D1.A
N$2
  Top 0.381: D2.A 37.59,97.27 58,117.68 R2.1
N$4
  Top 1.016: DRIV1.7 101.6,93.98 102.11,94.49 102.11,99.57 102.62,100.08 R3.1
N$5
  Top 0.762: R3.2 MOS1.1
N$6
  Top 1.016: DRIV1.5 96.52,91.44 96.9,91.06 96.9,88.14 97.66,87.38 R4.1
N$7  (via drill 0.35 pad 1.3)
  Top 1.016: MOS2.1 v110.62,87.38 | v102.49,87.38 R4.2
  Bottom 1.016: v110.62,87.38 v102.49,87.38
N$9
  Top 1.016: DRIV2.7 100.33,58.42 102.87,60.96 102.87,63.63 104.01,64.77 R5.1
N$10
  Top 1.016: DRIV2.5 99.06,55.88 99.95,54.99 99.95,53.72 100.58,53.09 R6.1
N$11
  Top 1.016: MOS3.1 107.78,64.52 R5.2
N$12
  Top 1.016: MOS4.1 R6.2
N$14
  Top 1.016: R7.1 106.21,26.42 98.84,19.05 DRIV3.7
N$15
  Top 1.016: DRIV3.5 96.9,16.51 98.17,15.24 R8.1
N$16
  Top 0.381: MOS5.1 R7.2
N$17
  Top 1.016: MOS6.1 108.58,16.26 107.57,15.24 R8.2
N$64  (via drill 0.35)
  Top 0.381: R31.1 v35.56,45.72 | v35.56,45.72 R28.2 | R37.1 v35.56,45.72 | R34.2 v35.56,33.02
  Bottom 0.381: v35.56,33.02 v35.56,45.72
N$65  (via drill 0.35)
  Top 0.381: R29.2 v40.64,40.64 R32.1 | R35.2 v40.64,33.02 | R38.1 v40.64,48.26
  Bottom 0.381: v40.64,33.02 v40.64,40.64 v40.64,48.26
N$66  (via drill 0.35)
  Top 0.381: R30.2 v45.72,35.56 | v45.72,35.56 R33.1 | R36.2 v45.72,35.56 | R39.1 v45.72,48.26
  Bottom 0.381: v45.72,48.26 v45.72,35.56
NRST  (via drill 0.35 pad 0.9)
  Top 0.381: R27.1 24.13,123.83 23.5,124.46 22.23,124.46 21.59,123.83 21.59,118.11 20.32,116.84 19.05,116.84 | v32.77,61.72 32.77,61.62 STM1.NRST | 19.05,116.84 19.05,115.57 v17.78,114.3 | C25.1 19.05,116.84 | J1.5 12.7,43.18 16.51,46.99 16.51,55.88 22.35,61.72 v32.77,61.72 | S1.2 32.77,62.59 v32.77,61.72
  Bottom 0.381: v17.78,114.3 13.97,110.49 13.97,87.63 30.23,71.37 30.23,64.26 v32.77,61.72
PHASE_A1  (via drill 0.35 pad 1.3)
  Top 0.762: R31.2 63.5,45.72 v64.77,44.45
  Top 1.016: 105.28,92.71 105.28,94.74 108.33,97.79 MOS1.2 MOS1.4 | 105.28,92.71 105.28,86.87 109.35,82.8 MOS2.3 | C2.2 123.19,106.68 128.27,101.6 128.27,97.79 | 130.81,97.79 130.78,97.76 | DRIV1.6 105.28,92.71
  Top 2.54: MOS1.4 128.27,97.79 130.81,97.79 | 130.78,97.76 138.43,90.11 OUT1.1
  Bottom 0.762: OUT1.1 132.72,66.67 129.54,63.5 129.54,45.72 123.95,40.13 66.55,40.13 64.77,41.91 v64.77,44.45
PHASE_B1  (via drill 0.35 pad 1.3)
  Top 0.762: R32.2 62.23,40.64 v64.77,38.1 | v132.08,41.91 132.08,62.23
  Top 1.016: 138.18,62.23 OUT1.2 | C4.2 111.76,72.39 119.32,64.83 MOS3.4 | MOS3.4 MOS3.2 | 109.22,62.23 107.95,62.23 102.87,57.15 DRIV2.6 | MOS4.3 110.24,48.51 v109.22,49.53 | v109.22,59.69 109.22,62.23 | MOS3.4 109.22,62.23
  Top 2.54: MOS3.4 132.08,62.23 138.18,62.23
  Bottom 0.762: v132.08,41.91 128.27,38.1 v64.77,38.1
  Bottom 1.016: v109.22,49.53 v109.22,59.69
PHASE_C1  (via drill 0.35 pad 1.3)
  Top 0.762: R33.2 v63.5,35.56 | v106.68,35.56 110.49,35.56 110.49,33.02
  Top 1.016: C6.2 110.49,33.02 115.57,33.02 119.32,29.27 MOS5.4 MOS5.2 110.49,25.4 109.22,24.13 109.22,20.32 | 109.22,20.32 v109.22,19.05 | DRIV3.6 101.6,17.78 104.14,20.32 109.22,20.32 | v109.22,12.7 110.24,11.68 MOS6.3
  Top 2.54: MOS5.4 124.4,25.4 138.43,39.43 OUT1.3
  Bottom 0.762: v63.5,35.56 v106.68,35.56
  Bottom 1.016: v109.22,12.7 v109.22,19.05
PWM_IN  (via drill 0.35, 0.55)
  Top 0.381: STM1.PA6 53.38,53.94 v54.61,52.7
  Top 0.762: JP1.1 38.1,22.86 50.8,22.86 v54.61,26.67
  Bottom 0.762: v54.61,52.7 v54.61,26.67
SWCLK  (via drill 0.35)
  Top 0.381: J1.2 v17.78,21.59 | v25.4,21.59 30.48,26.67 49.53,26.67 53.34,30.48 55.88,30.48 57.15,31.75 v57.15,33.02 | STM1.PA14 58.04,64.01 62.99,64.01 v63.5,63.5
  Bottom 0.381: v17.78,21.59 v25.4,21.59 | v57.15,33.02 57.15,50.8 63.5,57.15 v63.5,63.5
SWDIO  (via drill 0.35)
  Top 0.381: J1.4 10.16,29.21 10.16,43.18 12.7,45.72 12.7,46.99 11.43,48.26 11.43,55.88 25.4,69.85 v36.83,69.85 | v56.52,69.22 56.58,69.15 STM1.PA15
  Bottom 0.381: v36.83,69.85 40.64,73.66 53.34,73.66 56.52,70.48 v56.52,69.22
TEST_LED1  (via drill 0.35)
  Top 0.381: v63.5,114.3 48.26,99.06 48.26,71.63 53.38,66.51 STM1.PB6 | RED.A v85.09,115.57
  Bottom 0.381: v85.09,115.57 83.82,114.3 v63.5,114.3
TEST_LED2  (via drill 0.35)
  Top 0.381: BLUE.A 90.17,116.84 v88.9,115.57 | v64.77,111.76 49.53,96.52 49.53,71.63 54.18,66.98 STM1.PB5
  Bottom 0.381: v88.9,115.57 85.09,111.76 v64.77,111.76
TEST_LED3  (via drill 0.35)
  Top 0.381: STM1.PB4 54.98,67.19 51.05,71.12 51.05,94.23 v66.04,109.22 | YELLOW.A 95.25,118.11 v92.71,115.57
  Bottom 0.381: v92.71,115.57 86.36,109.22 v66.04,109.22
TEST_LED4  (via drill 0.35)
  Top 0.381: STM1.PB3 55.78,67.79 52.58,70.99 52.58,93.22 v66.04,106.68 | v96.52,114.3 100.33,118.11 GREEN.A
  Bottom 0.381: v66.04,106.68 66.93,107.57 89.79,107.57 v96.52,114.3
TIM1  (via drill 0.35)
  Top 0.381: STM1.PB0 54.98,54.62 55.88,53.72 v55.88,53.34
  Bottom 0.381: v55.88,53.34 55.88,31.75 57.15,30.48 57.15,11.43 R9.2
VB_1
  Top 1.016: DRIV1.8 99.06,95.25 100.33,96.52 100.33,100.33 | 100.33,100.33 100.33,104.14 102.87,106.68 C2.1 | 100.33,100.33 D3.P$2
VB_2
  Top 1.016: D4.P$2 97.72,72.39 99.06,72.39 | 99.06,72.39 C4.1 | DRIV2.8 97.79,59.69 99.06,60.96 99.06,72.39
VB_3
  Top 1.016: DRIV3.8 97.19,20.32 97.49,20.62 97.49,24.13 | D5.P$2 97.49,24.13 | 97.49,24.13 97.49,25.7 93.98,29.21 93.98,31.75 95.25,33.02 C6.1
VCC_1
  Top 0.381: R9.3 44.53,3.81 27.94,3.81 20.32,11.43 | 20.32,11.43 20.32,55.88 25.26,60.82 STM1.VDDA | J1.1 20.32,11.43
  Top 0.762: STM1.VDDA 52.69,60.82 53.34,61.47 53.34,63.5 52.82,64.02 STM1.VDD 48.26,64.02 23.12,89.16 23.12,110.75 27.94,115.57 27.94,123.19 | POWER.3.3V 4.32,102.11 5.08,102.87 16.51,102.87 20.32,106.68 20.32,113.03 24.13,116.84 R27.2
  Top 1.016: 27.94,123.19 3.3V_TEST.1
  pour Top (isolate 0.508): 35.56,127 35.56,119.13 35.05,118.62 24,118.62 22.99,119.63 22.99,126.36 23.11,126.49 23.62,127
VCC_2  (via drill 0.35 pad 1.3)
  Top 0.762: 12V_TEST.1 R2.2 | DRIV2.1 87.63,59.69 85.09,62.23 | D4.P$1 90.17,68.58 87.63,66.04 87.63,62.23 85.09,62.23 | MOS3.3 113.06,57.12 114.3,55.88 123.19,55.88 125.73,53.34 125.73,45.72 121.92,41.91 76.2,41.91 74.93,43.18 74.93,46.99 | v20.32,97.79 8.89,97.79 7.62,96.52 7.62,81.28 11.43,77.47 11.43,71.12 6.86,66.55 POWER.12V@9 | 85.09,62.23 76.2,62.23 74.93,60.96 74.93,46.99 | C3.1 74.93,46.99
  Top 1.016: D5.P$1 90.17,22.64 DRIV3.1 78.74,20.32 73.66,15.24 73.66,13.97 82.55,5.08 85.47,5.08 | MOS5.3 113.06,20.3 114.3,19.05 125.73,19.05 127,17.78 127,8.89 123.19,5.08 85.47,5.08 | 86.36,100.33 87.63,100.33 | 86.36,100.33 73.66,100.33 | 12V_TEST.1 v53.34,120.65 | MOS1.3 v109.22,95.5 | v87.63,105.41 87.63,100.33 | 73.66,100.33 73.66,118.11 71.12,120.65 v66.04,120.65 | 73.66,100.33 73.66,99.06 76.2,96.52 C1.1 | C5.1 85.6,5.21 85.47,5.08 | D3.P$1 87.63,100.33 | DRIV1.1 87.63,95.25 86.36,96.52 86.36,100.33
  Bottom 0.762: 12V_TEST.1 41.91,116.84 41.91,106.68 33.02,97.79 v20.32,97.79
  Bottom 1.016: v53.34,120.65 v66.04,120.65 | v109.22,95.5 106.81,95.5 104.52,97.79 97.16,97.79 95.76,99.19 95.76,104.39 94.11,106.05 88.27,106.05 v87.63,105.41
  pour Top (isolate 1.27): 46.83,127 47.47,116.84 71.12,116.84 71.12,13.97 78.74,13.97 78.74,127
  pour Top (isolate 1.27): 3.81,72.39 7.62,72.39 9.4,70.61 9.4,58.8 2.03,58.8 2.03,70.61